# EAGLE design cpx-module1-F (EAGLE 8.7.0)
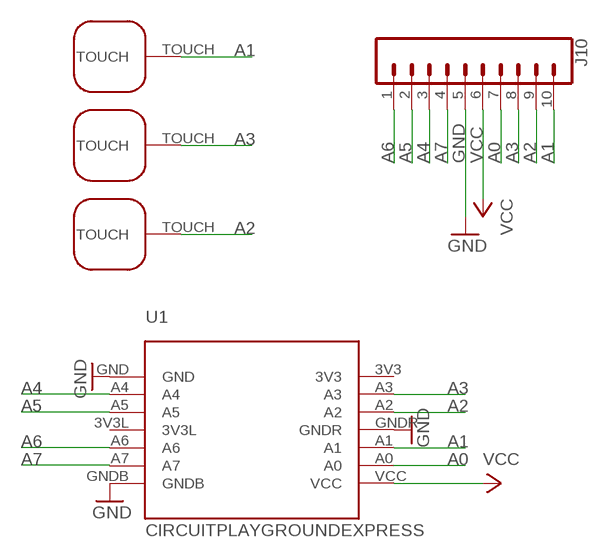
[diagram p0: schematic, sheet 1]

## Parts
J10  CONN_10"  [1X10]
T1  TOUCHPADROUND1  [TOUCHPAD1]
T2  TOUCHPADROUND1  [TOUCHPAD1]
T4  TOUCHPADROUND1  [TOUCHPAD1]
U1  CIRCUITPLAYGROUNDEXPRESS  [CIRCUITPLAYGROUNDEXPRESS]

## Nets
A0: J10.7 U1.A0
A1: J10.10 T2.TOUCH U1.A1
A2: J10.9 T4.TOUCH U1.A2
A3: J10.8 T1.TOUCH U1.A3
A4: J10.3 U1.A4
A5: J10.2 U1.A5
A6: J10.1 U1.A6
A7: J10.4 U1.A7
GND: J10.5 U1.GND U1.GNDB U1.GNDR
VCC: J10.6 U1.VCC
Unconnected: U1.3V3 U1.3V3L

## Library data of the parts
J10 = SparkFun-Connectors:CONN_10: Multi connection point. Often used as Generic Header-pin footprint for 0.1 inch spaced/style header connections On any of the 0.1 inch spaced packages, you can populate with these: Break Away Headers - Straight <https://www.sparkfun.com/products/116> (PRT-00116) Break Away Male Headers - Right Angle <https://www.sparkfun.com/products/553> (PRT-00553) Female Headers <https://www.sparkfun.com/products/115> (PRT-00115) Break Away Headers - Machine Pin <https://www.sparkfun.com/products/117> (PRT-00117) Break Away Female Headers - Swiss Machine Pin <https://www.sparkfun.com/products/743> (PRT-00743) Arduino Stackable Header - 10 Pin <https://www.sparkfun.com/products/11376> (PRT-11376) For SCREWTERMINALS and SPRING TERMINALS visit here: Screw Terimnals on SparkFun.com <https://www.sparkfun.com/search/results?term=Screw+Terminals> (5mm/3.5mm/2.54mm spacing) This device is also useful as a general connection point to wire up your design to another part of your project. Our various solder wires solder well into these plated through hole pads. Hook-Up Wire - Assortment (Stranded, 22 AWG) <https://www.sparkfun.com/products/11375> (PRT-11375) Hook-Up Wire - Assortment (Solid Core, 22 AWG) <https://www.sparkfun.com/products/11367> (PRT-11367) View the entire wire category on our website here <https://www.sparkfun.com/categories/141> Special notes: Molex polarized connector foot print use with SKU : PRT-08231 with associated crimp pins and housings. 1MM SMD Version SKU: PRT-10208 NOTES ON THE VARIANTS LOCK and LOCK_LONGPADS... This footprint was designed to help hold the alignment of a through-hole component (i.e. 6-pin header) while soldering it into place. You may notice that each hole has been shifted either up or down by 0.005 of an inch from it's more standard position (which is a perfectly straight line). This slight alteration caused the pins (the squares in the middle) to touch the edges of the holes. Because they are alternating, it causes a "brace" to hold the component in place. 0.005 has proven to be the perfect amount of "off-center" position when using our standard breakaway headers. Although looks a little odd when you look at the bare footprint, once you have a header in there, the alteration is very hard to notice. Also,if you push a header all the way into place, it is covered up entirely on the bottom side.; PROD_ID: CONN-11563
T1 T2 T4 = todstuff:TOUCHPAD
U1 = todstuff:CIRCUITPLAYGROUNDEXPRESS

## Board
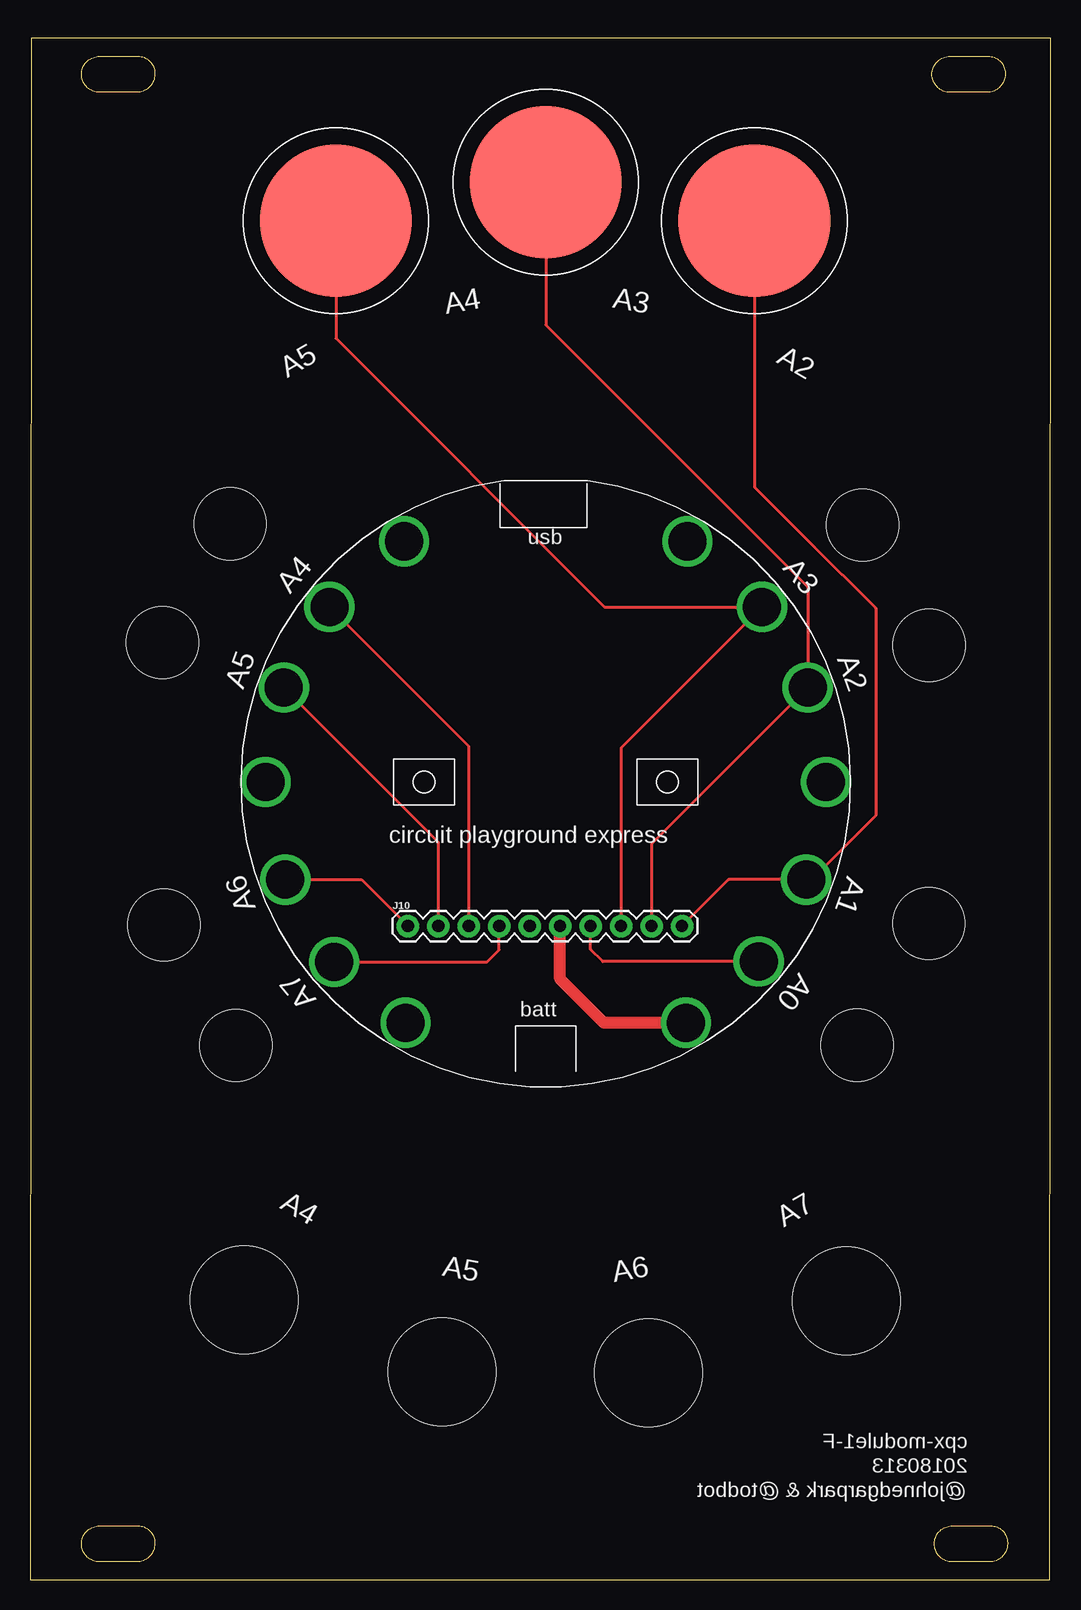
[diagram p1: board, top side]
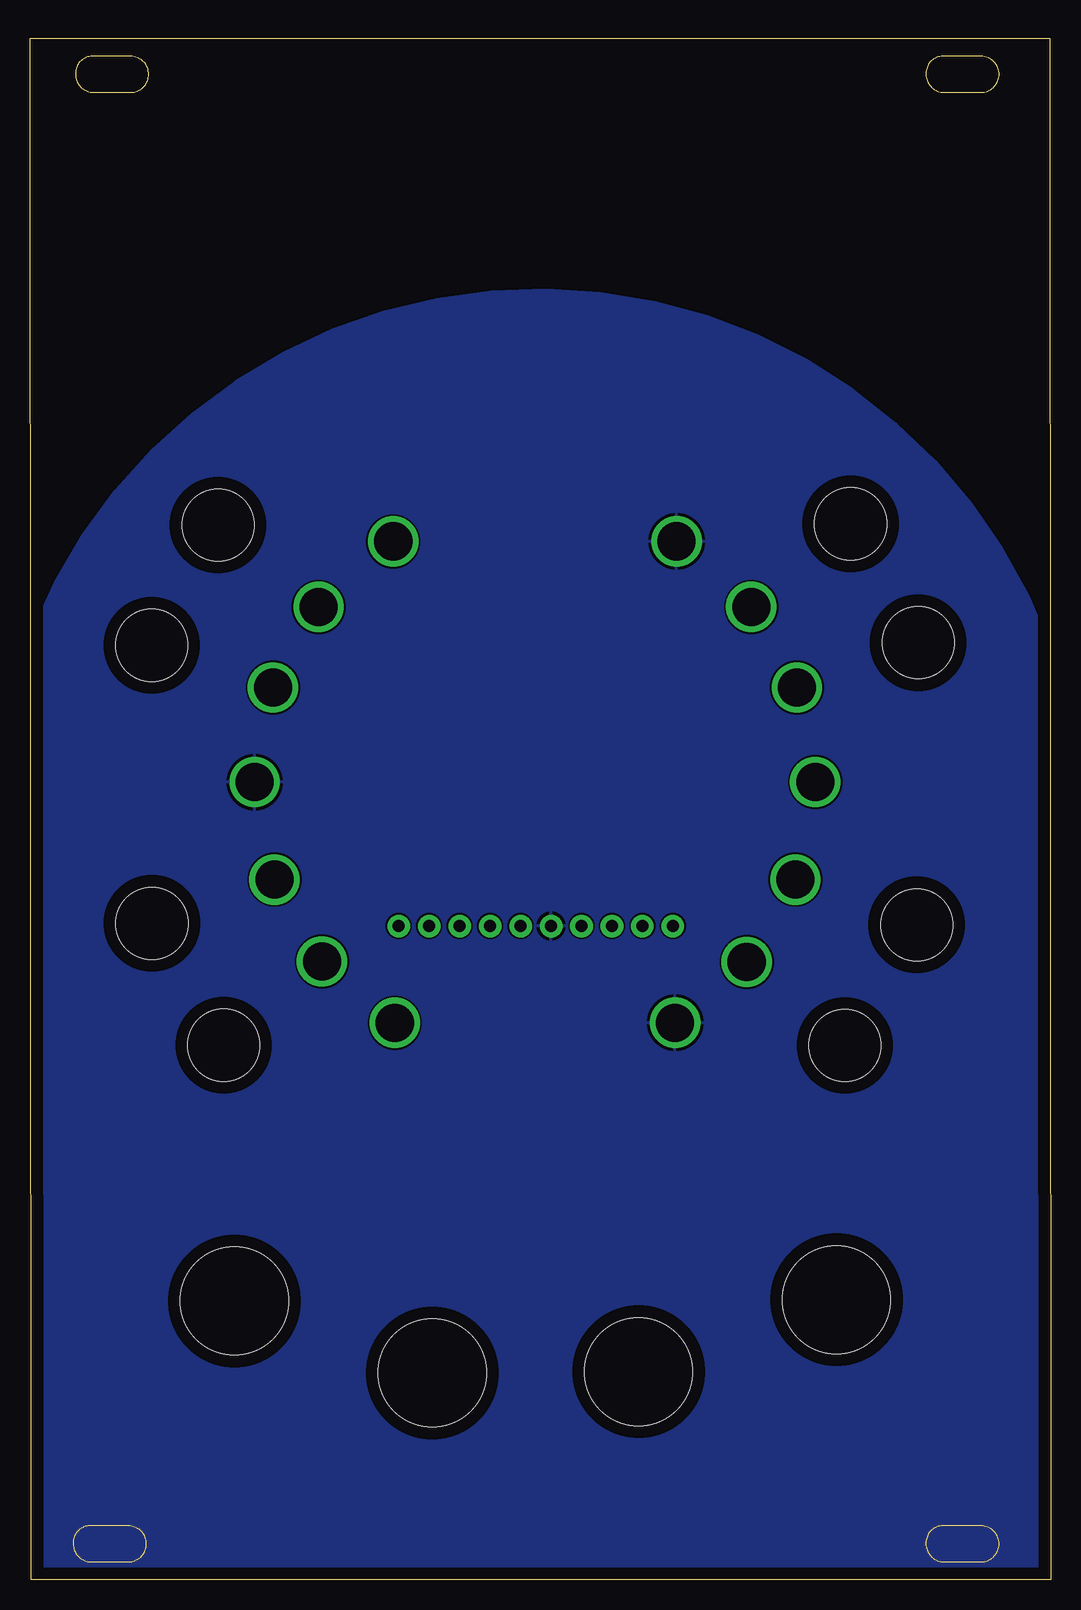
[diagram p2: board, bottom side, seen from below]

Size 85.1 x 128.5 mm. Coordinates in mm from the lower left corner, seen from the top.
Outline: 0,0 85,0 85.1,128.5 0.1,128.5 0,0
Copper layers (1*16): Top 0.035mm / dielectric 1.5mm / Bottom 0.035mm
Design rules "default": minimum track width 6mil, minimum drill 0.35mm, track to track 6mil, track to pad 6mil, pad to pad 6mil, via to via 6mil, smd to smd 6mil, copper to edge 40mil, drill to drill 6mil, minimum pad ring 10mil, minimum via ring 8mil, stop-mask expansion 4mil, vias tented up to drill 0mil, thermal gap 10mil
Holes 6 mm at 16.68,88.02 11.05,78.12 11.17,54.6 17.16,44.55 68.96,44.56 74.93,54.72 74.95,77.89 69.42,87.92
Holes 9 mm at 17.86,23.34 34.36,17.34 51.56,17.24 68.06,23.24
Milling: 28 lines

### Footprints (pad centres in the part's own frame; a part is rotated, then mirrored left to right if it is on the bottom)
1X10 = drill 1.016 pad 1.88: 1 0,0; 2 2.54,0; 3 5.08,0; 4 7.62,0; 5 10.16,0; 6 12.7,0; 7 15.24,0; 8 17.78,0; 9 20.32,0; 10 22.86,0
TOUCHPAD1 = smd 12.7 x 12.7: TOUCH 0,0
CIRCUITPLAYGROUNDEXPRESS = drill 3.175: 3V3 11.811,20.066; 3V3L -23.368,0; A0 17.755,-14.961; A1 21.717,-8.128; A2 21.844,7.874; A3 18.034,14.605; A4 -18.034,14.605; A5 -21.844,7.874; A6 -21.717,-8.128; A7 -17.653,-14.986; GND -11.811,20.066; GNDB -11.684,-20.066; GNDR 23.368,0; VCC 11.684,-20.066

### Placement (x,y rotation side)
J10  31.5,54.5 0 top
T1  25.5,113.3 0 top
T2  60.4,113.3 0 top
T4  43,116.5 0 top
U1  43,66.5 0 top

### Tracks (layer width: path | path; a pad name or v marks a point on that pad's centre or on a via)
A0
  Top 0.254: U1.A0 47.76,51.54 46.74,52.56 J10.7
A1
  Top 0.254: J10.10 58.23,58.37 U1.A1 65.17,58.37 70.5,63.7 70.5,81 67.72,83.78 67.7,83.78 60.4,91.08 T2.TOUCH
A2
  Top 0.254: J10.9 51.82,61.35 U1.A2 64.84,82.76 43,104.6 T4.TOUCH
A3
  Top 0.254: J10.8 49.28,69.35 U1.A3 47.89,81.11 25.5,103.5 T1.TOUCH
A4
  Top 0.254: U1.A4 36.58,69.49 J10.3
A5
  Top 0.254: U1.A5 34.04,61.49 J10.2
A6
  Top 0.254: U1.A6 27.63,58.37 J10.1
A7
  Top 0.254: U1.A7 38.11,51.51 39.12,52.52 J10.4
GND
  pour Bottom: 0.1,77.8 arc-138 84.9,79 85,-2.7 arc-143 -0.2,-3.3
VCC
  Top 1.016: U1.VCC 47.87,46.43 44.2,50.1 J10.6

### Text on the board
tPlace: A3 | A4 | A2 | A5 | A3 | A4 | A2 | A5 | A1 | A6 | A0 | A7 | A4 | A7 | A5 | A6 | cpx-module1-F | 20180313 | @johnedgarpark & @todbot